# EasyEDA Pro project Smart_System.eprj

# Schematic Schematic1
Create Date: 2024-04-11; Page Name: P1; Project Name: Smart_System; Schematic Name: Schematic1; Update Date: 2024-04-11; Company: 嘉立创EDA; Page Size: A4; Version: V1.0
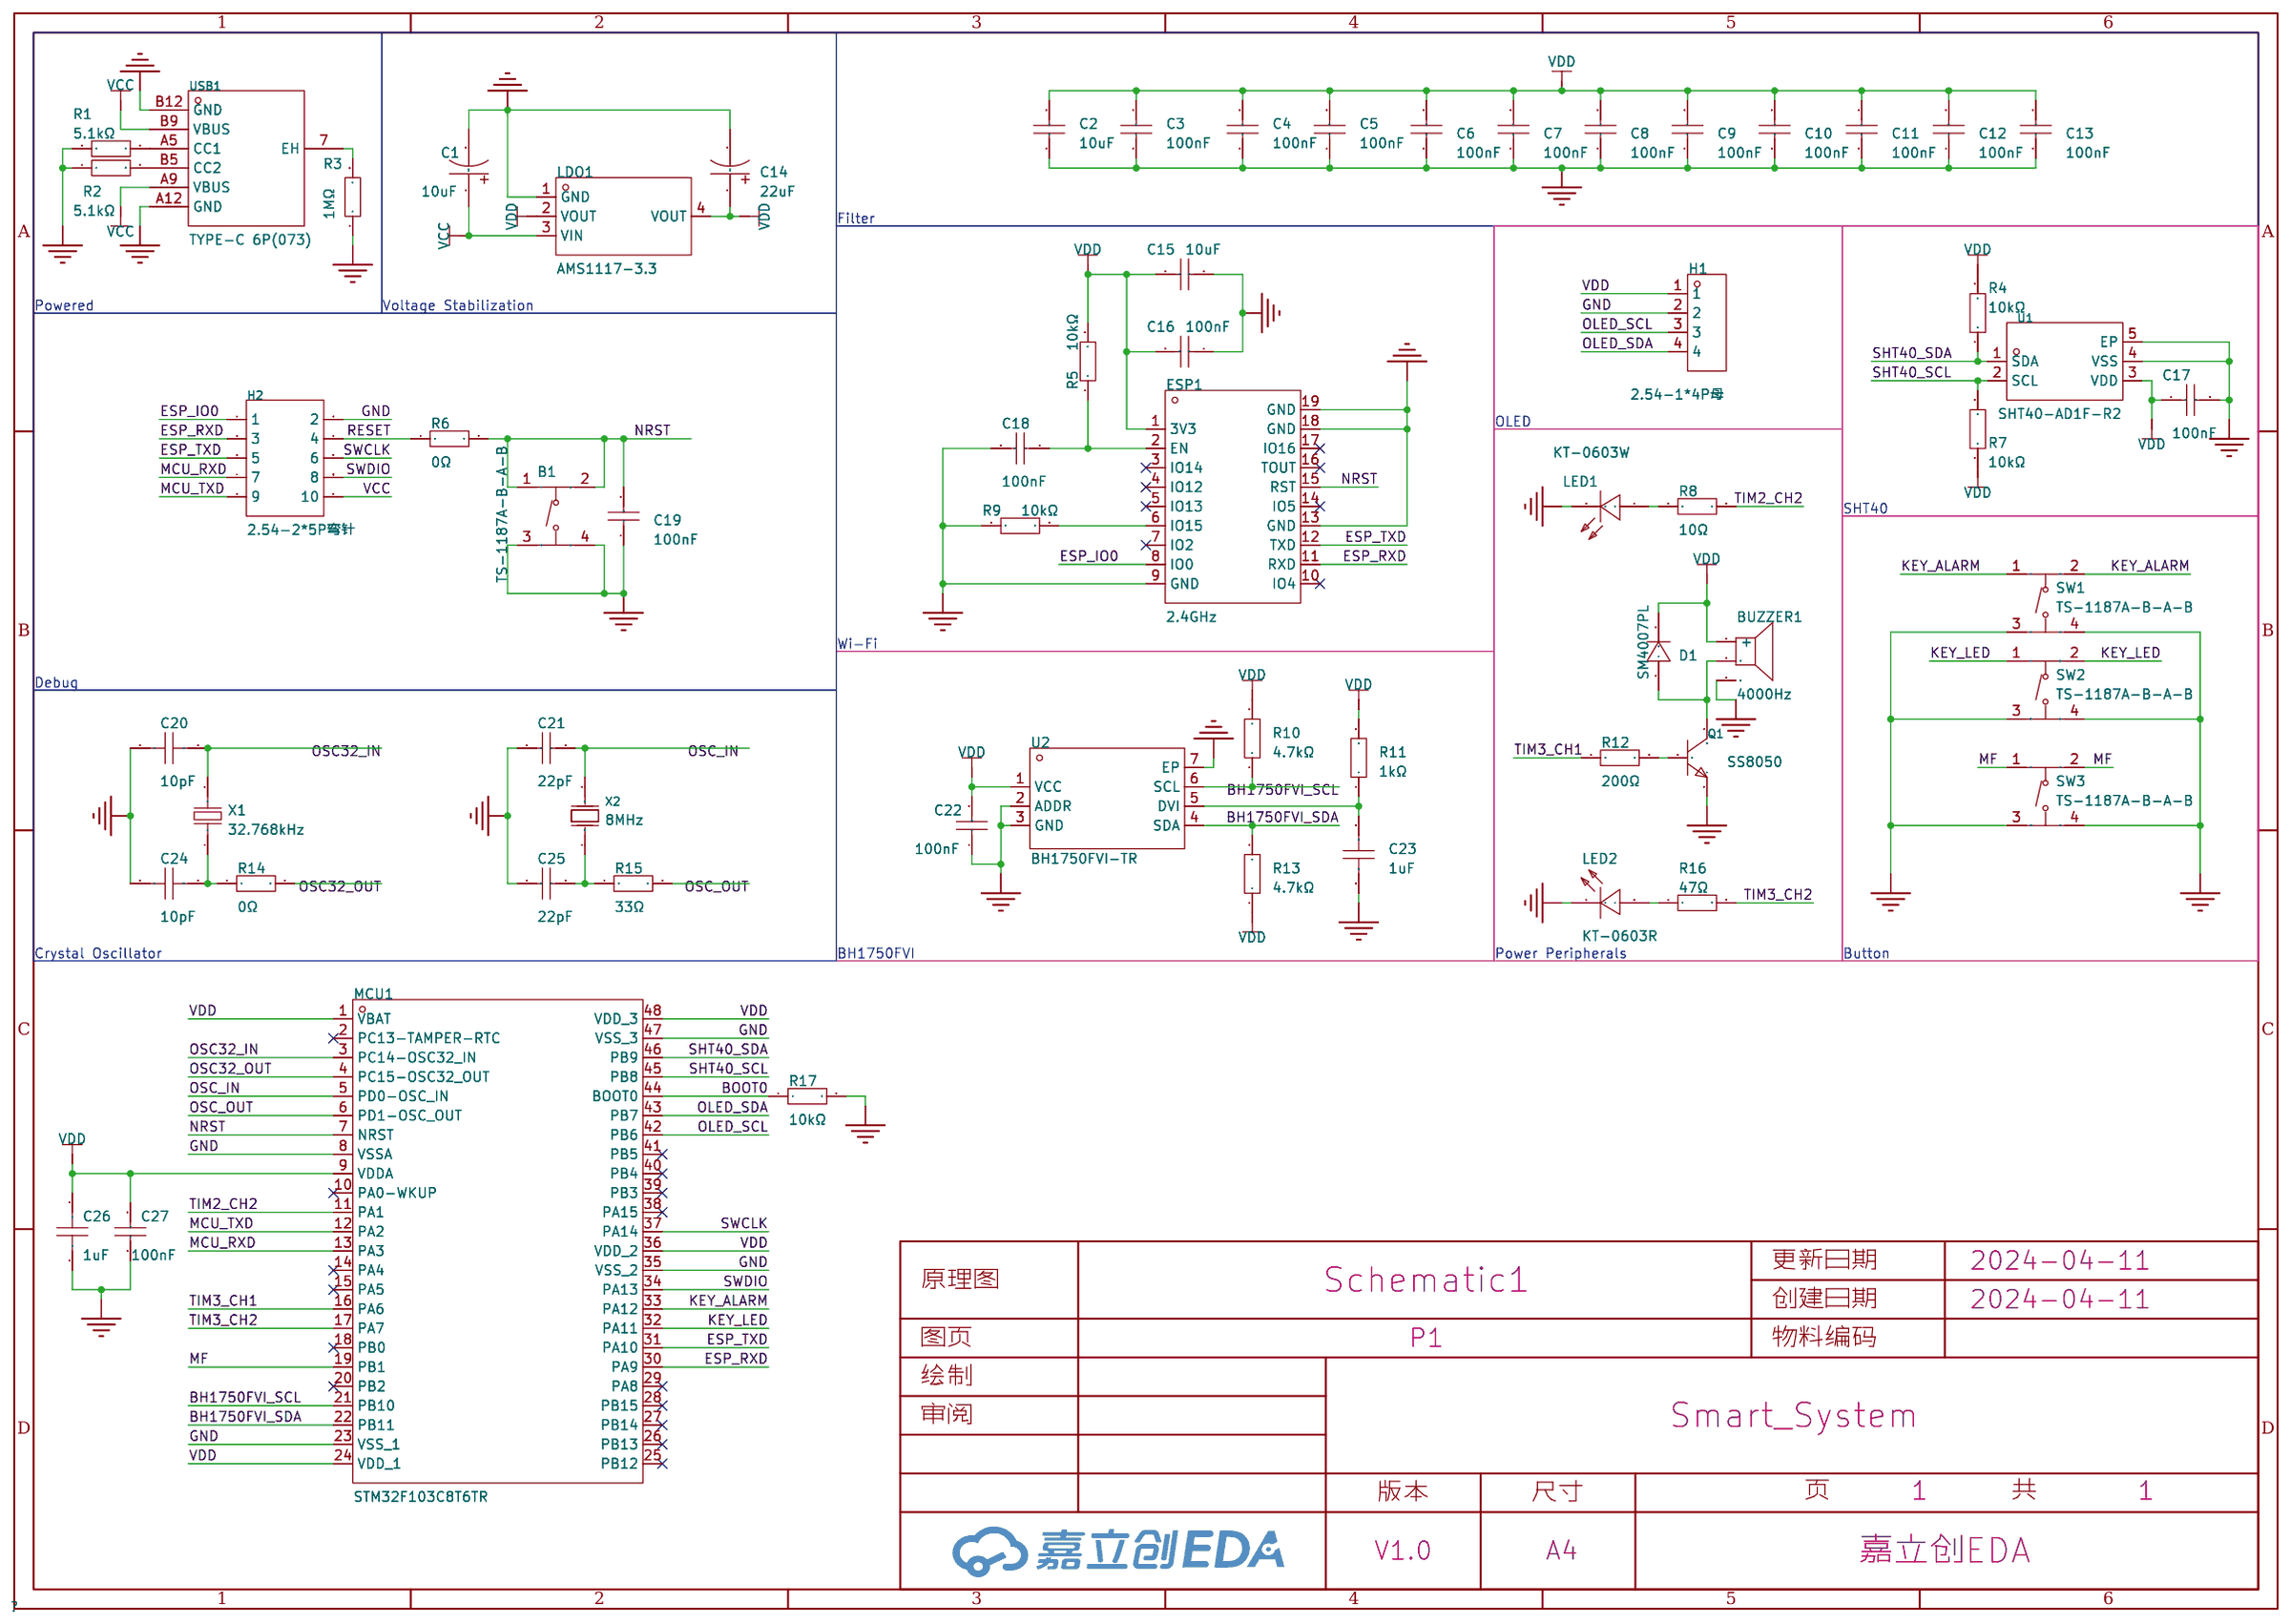
[diagram p0: schematic sheet]

## Parts
B1  TS-1187A-B-A-B  [SW-SMD_4P-L5.1-W5.1-P3.70-LS6.5-TL-2]
BUZZER1  4000Hz  [BUZ-SMD_FST-5018]
C1  10uF  [CAP-SMD_BD3.0-L3.3-W3.3-FD]
C2  10uF  [C0402]
C3  100nF  [C0402]
C4  100nF  [C0402]
C5  100nF  [C0402]
C6  100nF  [C0402]
C7  100nF  [C0402]
C8  100nF  [C0402]
C9  100nF  [C0402]
C10  100nF  [C0402]
C11  100nF  [C0402]
C12  100nF  [C0402]
C13  100nF  [C0402]
C14  22uF  [CAP-SMD_BD3.0-L3.3-W3.3-FD]
C15  10uF  [C0402]
C16  100nF  [C0402]
C17  100nF  [C0402]
C18  100nF  [C0402]
C19  100nF  [C0402]
C20  10pF  [C0402]
C21  22pF  [C0402]
C22  100nF  [C0402]
C23  1uF  [C0402]
C24  10pF  [C0402]
C25  22pF  [C0402]
C26  1uF  [C0402]
C27  100nF  [C0402]
D1  SM4007PL  [SOD-123F_L2.8-W1.8-LS3.7-RD]
ESP1  2.4GHz  [WIFIM-SMD_18P-L18.0-W20.0-P1.50]
H1  2.54-1*4P母  [HDR-TH_4P-P2.54-V-F]
H2  2.54-2*5P弯针  [HDR-TH_10P-P2.54-H-M-R2-C5-S2.54-W12.9]
LDO1  AMS1117-3.3  [SOT-223-3_L6.5-W3.4-P2.30-LS7.0-BR]
LED1  KT-0603W  [LED0603-R-RD_WHITE]
LED2  KT-0603R  [LED0603-RD]
MCU1  STM32F103C8T6TR  [LQFP-48_L7.0-W7.0-P0.50-LS9.0-BL]
Q1  SS8050  [SOT-23-3_L2.9-W1.3-P1.90-LS2.4-BR]
R1  5.1kΩ  [R0603]
R2  5.1kΩ  [R0603]
R3  1MΩ  [R0603]
R4  10kΩ  [R0402]
R5  10kΩ  [R0402]
R6  0Ω  [R0402]
R7  10kΩ  [R0402]
R8  10Ω  [R0402]
R9  10kΩ  [R0402]
R10  4.7kΩ  [R0402]
R11  1kΩ  [R0402]
R12  200Ω  [R0402]
R13  4.7kΩ  [R0402]
R14  0Ω  [R0402]
R15  33Ω  [R0402]
R16  47Ω  [R0603]
R17  10kΩ  [R0402]
SW1  TS-1187A-B-A-B  [SW-SMD_4P-L5.1-W5.1-P3.70-LS6.5-TL-2]
SW2  TS-1187A-B-A-B  [SW-SMD_4P-L5.1-W5.1-P3.70-LS6.5-TL-2]
SW3  TS-1187A-B-A-B  [SW-SMD_4P-L5.1-W5.1-P3.70-LS6.5-TL-2]
U1  SHT40-AD1F-R2  [DFN-4_L1.5-W1.5-P0.80-TL-EP]
U2  BH1750FVI-TR  [WSOF-6_L2.6-W1.6-P0.50-TL-EP]
USB1  TYPE-C 6P(073)  [TYPE-C-SMD_TYPE-C-6P]
X1  32.768kHz  [FC-135R_L3.2-W1.5]
X2  8MHz  [CRYSTAL-SMD_L5.0-W3.2]

## Library data of the parts
B1 SW1-SW3 = TS-1187A-B-A-B: 触点电流:50mA;额定电压(DC):12V;绝缘电阻:-;电路结构:单刀单掷;安装方式:立贴;带灯:无;作用力:160gf;机械寿命:10万次;带支架:否;; LCSC Part Name: 5.1*5.1*1.5mm 立贴 轻触开关 防水金属头; Supplier Part: C318884; Manufacturer: XKB Connectivity(中国星坤); Supplier Footprint: SMD; JLCPCB Part Class: 基础库; Datasheet: https://atta.szlcsc.com/upload/public/pdf/source/20200227/C318884_1F20165719E1C4CAA3E10C4C359C6E26.pdf; Supplier: LCSC; Contact Current: 50mA; Voltage Rating (DC): 12V; Circuit: 单刀单掷; Mounting Style: 立贴; Actuator Style: 圆形按钮; Actuator/Cap Color: 金色; With Lamp: 无; Operating Force: 160gf; Mechanical Life: 10万次; Operating Temperature: -30℃~+85℃; Switch Length: 5.1mm; Switch Width: 5.1mm; Switch Height: 1.5mm; Strike Gundam: 否
BUZZER1 = FUET-5018: 驱动方式:无源(外部驱动);构造类型:电磁式;额定电压:3V;工作电压:2V~5V;频率:4000Hz;声压(SPL):75dB@3V,10cm;长度:5.4mm;宽度:5.2mm;高度:2.1mm;; LCSC Part Name: 电压 3V 频率 4KHZ; Supplier Part: C391028; Manufacturer: FUET(福声科技); Supplier Footprint: SMD,5.2x5.4mm; JLCPCB Part Class: 扩展库; Datasheet: https://atta.szlcsc.com/upload/public/pdf/source/20191031/C391028_6BCD6F9247698B2FA578EDE11021CCC5.pdf; Supplier: LCSC; Oscillator Circuit: 无源(外部驱动); Technology Type: 电磁式; Rated Voltage: 3V; Operating Voltage: 2V~5V; Sound Pressure Level (SPL): 75dB@3V,10cm; Length: 5.4mm; Width: 5.2mm; Height: 2.1mm
C1 = VE-100M1CTR-0305: 容值:10uF;精度:±20%;额定电压:16V;纹波电流:-;等效串联电阻:-;; LCSC Part Name: 10uF ±20% 16V; Supplier Part: C249450; Manufacturer: lelon(立隆); Supplier Footprint: SMD,D3xL5.3mm; JLCPCB Part Class: Extended Part; Datasheet: https://atta.szlcsc.com/upload/public/pdf/source/20181115/C249450_E40C6B129E7EA1FA8176B540A70EDECB.pdf; Supplier: LCSC; Tolerance: ±20%; Rated Voltage: 16V; φD: 3mm; L: 5.3mm; Lifetime @ Temp: 2000hrs@85℃; Operating Temperature: -40℃~+85℃
C2 C15 = CL05A106MQ5NUNC: 容值:10uF;精度:±20%;额定电压:6.3V;材质(温度系数):X5R;; LCSC Part Name: 10uF ±20% 6.3V; Supplier Part: C15525; Manufacturer: SAMSUNG(三星); Supplier Footprint: 0402; JLCPCB Part Class: Basic Part; Datasheet: https://atta.szlcsc.com/upload/public/pdf/source/20220823/2B02EE04F8F211D38A52DCB16EB6BEBA.pdf; Supplier: LCSC; Tolerance: ±20%; Voltage Rated: 6.3V; Temperature Coefficient: X5R
C3-C13 C16 C18 C19 C27 = CL05B104KO5NNNC: 容值:100nF;精度:±10%;额定电压:16V;材质(温度系数):X7R;; LCSC Part Name: 100nF ±10% 16V; Supplier Part: C1525; Manufacturer: SAMSUNG(三星); Supplier Footprint: 0402; JLCPCB Part Class: Basic Part; Datasheet: https://atta.szlcsc.com/upload/public/pdf/source/20160218/1457707763339.pdf; Supplier: LCSC; Tolerance: ±10%; Voltage Rated: 16V; Temperature Coefficient: X7R
C14 = VE-220M1ATR-0305: 容值:22uF;精度:±20%;额定电压:10V;纹波电流:-;等效串联电阻:-;; LCSC Part Name: 22uF ±20% 10V; Supplier Part: C249481; Manufacturer: lelon(立隆); Supplier Footprint: SMD,D3xL5.3mm; JLCPCB Part Class: Extended Part; Datasheet: https://atta.szlcsc.com/upload/public/pdf/source/20181106/C249481_539A61700A3BC1DD3A45A0C2AB5D35A6.pdf; Supplier: LCSC; Tolerance: ±20%; Rated Voltage: 10V; φD: 3mm; L: 5.3mm; Lifetime @ Temp: 2000hrs@85℃; Operating Temperature: -40℃~+85℃
C17 C22 = CL05B104KO5NNNC: 容值:100nF;精度:±10%;额定电压:16V;材质(温度系数):X7R;; LCSC Part Name: 100nF ±10% 16V; Supplier Part: C1525; Manufacturer: SAMSUNG(三星); Supplier Footprint: 0402; JLCPCB Part Class: 基础库; Datasheet: https://atta.szlcsc.com/upload/public/pdf/source/20160218/1457707763339.pdf; Supplier: LCSC; Tolerance: ±10%; Voltage Rated: 16V; Temperature Coefficient: X7R
C20 C24 = CL05C100JB5NNNC: 容值:10pF;精度:±5%;额定电压:50V;材质(温度系数):C0G;; LCSC Part Name: 10pF ±5% 50V; Supplier Part: C32949; Manufacturer: SAMSUNG(三星); Supplier Footprint: 0402; JLCPCB Part Class: Basic Part; Datasheet: https://atta.szlcsc.com/upload/public/pdf/source/20160103/1457707722238.pdf; Supplier: LCSC; Tolerance: ±5%; Voltage Rated: 50V; Temperature Coefficient: C0G
C21 C25 = 0402CG220J500NT: 容值:22pF;精度:±5%;额定电压:50V;材质(温度系数):C0G;; LCSC Part Name: 22pF ±5% 50V; Supplier Part: C1555; Manufacturer: FH(风华); Supplier Footprint: 0402; JLCPCB Part Class: Basic Part; Datasheet: https://atta.szlcsc.com/upload/public/pdf/source/20200305/C486355_26A10D38EF8C2A5C37091D0039909270.pdf; Supplier: LCSC; Tolerance: ±5%; Voltage Rated: 50V; Temperature Coefficient: C0G
C23 C26 = CL05A105KA5NQNC: 容值:1uF;精度:±10%;额定电压:25V;材质(温度系数):X5R;; LCSC Part Name: 1uF ±10% 25V; Supplier Part: C52923; Manufacturer: SAMSUNG(三星); Supplier Footprint: 0402; JLCPCB Part Class: Basic Part; Datasheet: https://atta.szlcsc.com/upload/public/pdf/source/20160103/1457707735223.pdf; Supplier: LCSC; Tolerance: ±10%; Voltage Rated: 25V; Temperature Coefficient: X5R
D1 = SM4007PL_C64898: 二极管配置:-;正向压降(Vf):1.1V@1A;直流反向耐压(Vr):1kV;平均整流电流(Io):1A;; LCSC Part Name: 电压:1kV 电流:1A; Supplier Part: C64898; Manufacturer: MDD; Supplier Footprint: SOD-123FL; JLCPCB Part Class: Basic Part; Datasheet: https://atta.szlcsc.com/upload/public/pdf/source/20230823/16A8FDE162764C9B685A3717F2DA3690.pdf; Supplier: LCSC; Forward Voltage (Vf@If): 1.1V@1A; Reverse Voltage (Vr): 1kV; Average Rectified Current (Io): 1A; Reverse Leakage Current: 10uA@1kV
ESP1 = ESP-WROOM-02-N4_C529583: 频率:2.4GHz;发射功率:20.5dBm;核心处理器:ESP8266EX;; LCSC Part Name: ESP-WROOM-02-N4; Supplier Part: C529583; Manufacturer: ESPRESSIF(乐鑫); Manufacturer Part: ESP-WROOM-02-N4; Supplier Footprint: SMD-18P; JLCPCB Part Class: 扩展库; Datasheet: https://atta.szlcsc.com/upload/public/pdf/source/20200521/C529583_8D53E26E82F3F756972E34D813E274D9.pdf; Supplier: LCSC; Output Power: 20.5dBm; Core Processor: ESP8266EX; Support Interface: I2C；GPIO；PWM；UART；I2S
H1 = 2.54-1*4P母: 排数:单排;总孔位数:4P;间距:2.54mm;插孔结构:1x4P;行距:-;安装类型:直插;圆孔/方孔:方孔;额定电流:3A;额定电压:-;插孔方向:顶部;塑高:-;触头材质:青铜;触头镀层:-;工作温度范围:-40℃~+105℃;焊接温度(最大值):-;; LCSC Part Name: 间距:2.54mm 1x4P 直插; Supplier Part: C2718488; Manufacturer: BOOMELE(博穆精密); Supplier Footprint: 插件,P=2.54mm; JLCPCB Part Class: 扩展库; Datasheet: https://atta.szlcsc.com/upload/public/pdf/source/20210301/C2718488_F4427B881E42CAA8DDB0B1C12B3A522C.pdf; Supplier: LCSC; Number of Rows: 单排; Number of Holes: 4P; Pitch: 2.54mm; Holes Structure: 1x4P; Mounting Type: 直插; Circular Hole / Square Hole: 方孔; Current Rating (Max): 3A; Holes Direction: 顶部; Contact Material: 青铜; Operating Temperature Range: -40℃~+105℃
H2 = 2.54-2*5P弯针: 间距:2.54mm;总PIN位数:10;排数:2;插针结构:2x5P;行距:2.54mm;安装类型:弯插;圆针/方针:方针;额定电流:3A;额定电压:-;配合针长度:6mm;塑高:2.54mm;触头材质:黄铜;触头镀层:-;工作温度范围:-55℃~+105℃;颜色:黑色;; LCSC Part Name: 2.54mm 2x5P 弯插 方针; Supplier Part: C60563; Manufacturer: BOOMELE(博穆精密); Supplier Footprint: 插件,P=2.54mm; JLCPCB Part Class: 扩展库; Supplier: LCSC; Pitch: 2.54mm; Number of Pins: 10; Number of Rows: 2; Pin Structure: 2x5P; Row Spacing: 2.54mm; Mounting Type: 弯插; Circluar Pins/Square Pins: 方针; Current Rating (Max): 3A; Length of Mating Pin: 6mm; Insulation Height: 2.54mm; Contact Material: 黄铜; Operating Temperature Range: -55℃~+105℃; Color: 黑色
LDO1 = AMS1117-3.3_C6186: 输出类型:固定;输出极性:正;最大输入电压:-;输出电压:3.3V;输出电流:1A;电源纹波抑制比(PSRR):72dB@(120Hz);; LCSC Part Name: 输出3.3V 1A; Supplier Part: C6186; Manufacturer: AMS; Supplier Footprint: SOT-223; JLCPCB Part Class: 基础库; Datasheet: https://atta.szlcsc.com/upload/public/pdf/source/20180727/C6186_7A095716F0823C02F1997A905E26C086.pdf; Supplier: LCSC; Output Type: 固定; Output Polarity: 正; Number of Outputs: 1; Output Voltage: 3.3V; Dropout Voltage: 1.3V@(800mA); Output Current: 1A; Power Supply Rejection Ratio (PSRR): 72dB@(120Hz)
LED1 = KT-0603W: 发光颜色:白色;; LCSC Part Name: 0603 白灯 高亮; Supplier Part: C2290; Manufacturer: KENTO; Supplier Footprint: 0603; JLCPCB Part Class: 基础库; Datasheet: https://atta.szlcsc.com/upload/public/pdf/source/20221101/4C23D5C85BA051E44A00B833D0A41468.pdf; Supplier: LCSC; Emitted Color: 白色
LED2 = KT-0603R: 发光颜色:红灯;二极管配置:-;透镜颜色:-;主波长:-;色温:-;功率:-;发光角度:-;安装方式:-;工作温度:-40℃~+85℃;; LCSC Part Name: 0603 红灯 高亮; Supplier Part: C2286; Manufacturer: KENTO; Supplier Footprint: 0603; JLCPCB Part Class: 基础库; Datasheet: https://atta.szlcsc.com/upload/public/pdf/source/20160616/1466072038404.pdf; Supplier: LCSC; Emitted Color: 红灯; Operating Temperature: -40℃~+85℃
MCU1 = STM32F103C8T6TR: Supplier Part: C2969777; Manufacturer: ST(意法半导体); Supplier Footprint: LQFP-48; JLCPCB Part Class: 扩展库; Datasheet: https://atta.szlcsc.com/upload/public/pdf/source/20220628/95EE8CB51361BFD20205E6D0986143A8.pdf; Supplier: LCSC
Q1 = SS8050_C2150: 晶体管类型:NPN;集射极击穿电压(Vceo):25V;集电极电流(Ic):1.5A;功率(Pd):300mW;直流电流增益(hFE@Ic,Vce):200@100mA,1V;; LCSC Part Name: NPN 耐压:25V 电流:1.5A Y1 200-350; Supplier Part: C2150; Manufacturer: CJ(江苏长电/长晶); Supplier Footprint: SOT-23; JLCPCB Part Class: Basic Part; Datasheet: https://atta.szlcsc.com/upload/public/pdf/source/20230322/AEE86F4B043774EFF80CAEA14A37D9E9.pdf; Supplier: LCSC; Transistor Type: NPN; Collector-Emitter Breakdown Voltage (Vceo): 25V; Collector Current (Ic): 1.5A; Power Dissipation (Pd): 300mW; Collector Cut-Off Current (Icbo): 100nA; Collector-Emitter Saturation Voltage (VCE(sat)@Ic,Ib): 500mV@800mA,80mA; DC Current Gain (hFE@Ic,Vce): 200@100mA,1V; Transition Frequency (fT): 100MHz; Operating Temperature: +150℃@(Tj)
R1 R2 = 0603WAF5101T5E: 阻值:5.1kΩ;精度:±1%;功率:100mW;温度系数:±100ppm/℃;电阻类型:厚膜电阻;; LCSC Part Name: 5.1kΩ ±1% 100mW 厚膜电阻; Supplier Part: C23186; Manufacturer: UNI-ROYAL(厚声); Supplier Footprint: 0603; JLCPCB Part Class: Basic Part; Datasheet: https://atta.szlcsc.com/upload/public/pdf/source/20200306/C422600_1E6D84923E4A46A82E41ADD87F860B5C.pdf; Supplier: LCSC; Type: 厚膜电阻; Tolerance: ±1%; Power(Watts): 100mW; Temperature Coefficient: ±100ppm/℃; Overload Voltage (Max): 75V; Operating Temperature Range: -55℃~+155℃
R3 = 0603WAF1004T5E: 阻值:1MΩ;精度:±1%;功率:100mW;温度系数:±100ppm/℃;电阻类型:厚膜电阻;; LCSC Part Name: 1MΩ ±1% 100mW 厚膜电阻; Supplier Part: C22935; Manufacturer: UNI-ROYAL(厚声); Supplier Footprint: 0603; JLCPCB Part Class: Basic Part; Datasheet: https://atta.szlcsc.com/upload/public/pdf/source/20200306/C422600_1E6D84923E4A46A82E41ADD87F860B5C.pdf; Supplier: LCSC; Type: 厚膜电阻; Tolerance: ±1%; Power(Watts): 100mW; Temperature Coefficient: ±100ppm/℃; Overload Voltage (Max): 75V; Operating Temperature Range: -55℃~+155℃
R4 R7 = 0402WGF1002TCE: 电阻类型:厚膜电阻;阻值:10kΩ;精度:±1%;功率:62.5mW;温度系数:±100ppm/℃;; LCSC Part Name: 厚膜电阻 10kΩ ±1% 62.5mW; Supplier Part: C25744; Manufacturer: UNI-ROYAL(厚声); Supplier Footprint: 0402; JLCPCB Part Class: 基础库; Datasheet: https://atta.szlcsc.com/upload/public/pdf/source/20200306/C422600_1E6D84923E4A46A82E41ADD87F860B5C.pdf; Supplier: LCSC; Type: 厚膜电阻; Tolerance: ±1%; Power(Watts): 62.5mW; Temperature Coefficient: ±100ppm/℃; Overload Voltage (Max): 50V; Operating Temperature Range: -55℃~+155℃
R5 R9 R17 = 0402WGF1002TCE: 电阻类型:厚膜电阻;阻值:10kΩ;精度:±1%;功率:62.5mW;温度系数:±100ppm/℃;; LCSC Part Name: 厚膜电阻 10kΩ ±1% 62.5mW; Supplier Part: C25744; Manufacturer: UNI-ROYAL(厚声); Supplier Footprint: 0402; JLCPCB Part Class: Basic Part; Datasheet: https://atta.szlcsc.com/upload/public/pdf/source/20200306/C422600_1E6D84923E4A46A82E41ADD87F860B5C.pdf; Supplier: LCSC; Type: 厚膜电阻; Tolerance: ±1%; Power(Watts): 62.5mW; Temperature Coefficient: ±100ppm/℃; Overload Voltage (Max): 50V; Operating Temperature Range: -55℃~+155℃
R6 R14 = 0402WGF0000TCE: 阻值:0Ω;精度:±1%;功率:62.5mW;温度系数:±800ppm/℃;电阻类型:厚膜电阻;; LCSC Part Name: 0Ω ±1% 62.5mW 厚膜电阻; Supplier Part: C17168; Manufacturer: UNI-ROYAL(厚声); Supplier Footprint: 0402; JLCPCB Part Class: Basic Part; Datasheet: https://atta.szlcsc.com/upload/public/pdf/source/20200306/C422600_1E6D84923E4A46A82E41ADD87F860B5C.pdf; Supplier: LCSC; Tolerance: ±1%; Power(Watts): 62.5mW; Overload Voltage (Max): 50V; Temperature Coefficient: ±800ppm/℃; Type: 厚膜电阻; Operating Temperature Range: -55℃~+155℃
R8 = 0402WGF100JTCE: 电阻类型:厚膜电阻;阻值:10Ω;精度:±1%;功率:62.5mW;最大工作电压:50V;温度系数:±200ppm/℃;; LCSC Part Name: 10Ω ±1% 62.5mW 厚膜电阻; Supplier Part: C25077; Manufacturer: UNI-ROYAL(厚声); Supplier Footprint: 0402; JLCPCB Part Class: Basic Part; Datasheet: https://atta.szlcsc.com/upload/public/pdf/source/20200306/C422600_1E6D84923E4A46A82E41ADD87F860B5C.pdf; Supplier: LCSC; Type: 厚膜电阻; Tolerance: ±1%; Power(Watts): 62.5mW; Overload Voltage (Max): 50V; Temperature Coefficient: ±200ppm/℃; Operating Temperature Range: -55℃~+155℃
R10 R13 = 0402WGF4701TCE: 电阻类型:厚膜电阻;阻值:4.7kΩ;精度:±1%;功率:62.5mW;温度系数:±100ppm/℃;; LCSC Part Name: 厚膜电阻 4.7kΩ ±1% 62.5mW; Supplier Part: C25900; Manufacturer: UNI-ROYAL(厚声); Supplier Footprint: 0402; JLCPCB Part Class: 基础库; Datasheet: https://atta.szlcsc.com/upload/public/pdf/source/20200306/C422600_1E6D84923E4A46A82E41ADD87F860B5C.pdf; Supplier: LCSC; Type: 厚膜电阻; Tolerance: ±1%; Power(Watts): 62.5mW; Temperature Coefficient: ±100ppm/℃; Overload Voltage (Max): 50V; Operating Temperature Range: -55℃~+155℃
R11 = 0402WGF1001TCE: 电阻类型:厚膜电阻;阻值:1kΩ;精度:±1%;功率:62.5mW;; LCSC Part Name: 1kΩ ±1% 62.5mW; Supplier Part: C11702; Manufacturer: UNI-ROYAL(厚声); Supplier Footprint: 0402; JLCPCB Part Class: Basic Part; Datasheet: https://atta.szlcsc.com/upload/public/pdf/source/20200306/C422600_1E6D84923E4A46A82E41ADD87F860B5C.pdf; Supplier: LCSC; Type: 厚膜电阻; Tolerance: ±1%; Power(Watts): 62.5mW; Temperature Coefficient: ±100ppm/℃; Overload Voltage (Max): 50V; Operating Temperature Range: -55℃~+155℃
R12 = 0402WGF2000TCE: 阻值:200Ω;精度:±1%;功率:62.5mW;温度系数:±100ppm/℃;电阻类型:厚膜电阻;; LCSC Part Name: 200Ω ±1% 62.5mW 厚膜电阻; Supplier Part: C25087; Manufacturer: UNI-ROYAL(厚声); Supplier Footprint: 0402; JLCPCB Part Class: Basic Part; Datasheet: https://atta.szlcsc.com/upload/public/pdf/source/20200306/C422600_1E6D84923E4A46A82E41ADD87F860B5C.pdf; Supplier: LCSC; Type: 厚膜电阻; Tolerance: ±1%; Power(Watts): 62.5mW; Temperature Coefficient: ±100ppm/℃; Overload Voltage (Max): 50V; Operating Temperature Range: -55℃~+155℃
R15 = 0402WGF330JTCE: 阻值:33Ω;精度:±1%;功率:62.5mW;温度系数:±100ppm/℃;电阻类型:厚膜电阻;; LCSC Part Name: 33Ω ±1% 62.5mW 厚膜电阻; Supplier Part: C25105; Manufacturer: UNI-ROYAL(厚声); Supplier Footprint: 0402; JLCPCB Part Class: Basic Part; Datasheet: https://atta.szlcsc.com/upload/public/pdf/source/20200306/C422600_1E6D84923E4A46A82E41ADD87F860B5C.pdf; Supplier: LCSC; Tolerance: ±1%; Power(Watts): 62.5mW; Overload Voltage (Max): 50V; Temperature Coefficient: ±100ppm/℃; Type: 厚膜电阻; Operating Temperature Range: -55℃~+155℃
R16 = 0603WAF470JT5E: 阻值:47Ω;精度:±1%;功率:100mW;温度系数:±100ppm/℃;电阻类型:厚膜电阻;; LCSC Part Name: 47Ω ±1% 100mW 厚膜电阻; Supplier Part: C23182; Manufacturer: UNI-ROYAL(厚声); Supplier Footprint: 0603; JLCPCB Part Class: Basic Part; Datasheet: https://atta.szlcsc.com/upload/public/pdf/source/20200306/C422600_1E6D84923E4A46A82E41ADD87F860B5C.pdf; Supplier: LCSC; Tolerance: ±1%; Power(Watts): 100mW; Overload Voltage (Max): 75V; Temperature Coefficient: ±100ppm/℃; Type: 厚膜电阻; Operating Temperature Range: -55℃~+155℃
U1 = SHT40-AD1F-R2: LCSC Part Name: 3.000.820; Supplier Part: C7461846; Manufacturer: Sensirion(瑞士盛思锐); Supplier: LCSC
U2 = BH1750FVI-TR: 数字16-bit I2C串行输出，环境光传感器，工作电压：2.4V~3.6V; Supplier Part: C78960; Manufacturer: ROHM(罗姆); Supplier Footprint: WSOF-6; JLCPCB Part Class: 扩展库; Datasheet: https://atta.szlcsc.com/upload/public/pdf/source/20160723/1469258984787.pdf; Supplier: LCSC
USB1 = TYPE-C 6P(073): 连接器类型:Type-C;标准:-;公母:母座;触点数量:6P;端口数量:1;安装方式:卧贴;额定电流 - 电源:5A;工作温度范围:-25℃~+85℃;; LCSC Part Name: Type-C 母座 卧贴; Supplier Part: C668623; Manufacturer: SHOU HAN(首韩); Supplier Footprint: SMD; JLCPCB Part Class: 扩展库; Datasheet: https://atta.szlcsc.com/upload/public/pdf/source/20200618/C668623_A4B260DED7AC1949BAC6AE39E9F4CD80.pdf; Supplier: LCSC; Connector Type: Type-C; Gender: 母座; Number of Contacts: 6P; Number of Ports: 1; Mounting Style: 卧贴; Current Rating - Power (Max): 5A; Operating Temperature Range: -25℃~+85℃
X1 = Q13FC1350000400: 频率:32.768kHz;频率公差:±20ppm;负载电容:12.5pF;; LCSC Part Name: 32.768kHz ±20ppm 12.5pF; Supplier Part: C32346; Manufacturer: EPSON(爱普生); Supplier Footprint: SMD3215-2P; JLCPCB Part Class: Basic Part; Datasheet: https://atta.szlcsc.com/upload/public/pdf/source/20190108/C32346_746D6B07EAF90824457A96480007685F.pdf; Supplier: LCSC; Crystal Type: 贴片无源晶振; Frequency Tolerance: ±20ppm; Load Capacitance: 12.5pF; Equivalent Series Resistance (ESR): 70kΩ; Operating Temperature: -40℃~+85℃
X2 = X50328MSB2GI: 频率:8MHz;负载电容:20pF;频率公差:±10ppm;; LCSC Part Name: 8MHz ±10ppm 20pF YSX530GA YSX530GA; Supplier Part: C115962; Manufacturer: YXC(扬兴晶振); Supplier Footprint: SMD5032-2P; JLCPCB Part Class: Basic Part; Datasheet: https://atta.szlcsc.com/upload/public/pdf/source/20230220/0EBFFB9D6D8CE6A211407822BBB6C516.pdf; Supplier: LCSC; Crystal Type: 贴片无源晶振; Frequency Tolerance: ±10ppm; Frequency Stability: ±50ppm; Load Capacitance: 20pF; Operating Temperature: -40℃~+85℃

## Nets
GND: B1.3(C) B1.4(D) BUZZER1.3 C1.2 C2.1 C3.1 C4.1 C5.1 C6.1 C7.1 C8.1 C9.1 C10.1 C11.1 C12.1 C13.1 C14.2 C15.2 C16.1 C17.2 C18.2 C19.1 C20.1 C21.1 C22.1 C23.1 C24.1 C25.1 C26.1 C27.1 ESP1.9(GND) ESP1.13(GND) ESP1.18(GND) ESP1.19(GND) H1.2 H2.2 LDO1.1(GND) LED1.2(K) LED2.1(K) MCU1.8(VSSA) MCU1.23(VSS_1) MCU1.35(VSS_2) MCU1.47(VSS_3) Q1.2(E) R1.1 R2.1 R3.1 R9.1 R17.2 SW1.3(C) SW1.4(D) SW2.3(C) SW2.4(D) SW3.3(C) SW3.4(D) U1.4(VSS) U1.5(EP) U2.2(ADDR) U2.3(GND) U2.7(EP) USB1.A12(GND) USB1.B12(GND)
VCC: C1.1 H2.10 LDO1.3(VIN) USB1.A9(VBUS) USB1.B9(VBUS)
VDD: BUZZER1.1(+) C2.2 C3.2 C4.2 C5.2 C6.2 C7.2 C8.2 C9.2 C10.2 C11.2 C12.2 C13.2 C14.1 C15.1 C16.2 C17.1 C22.2 C26.2 C27.2 D1.1(C) ESP1.1(3V3) H1.1 LDO1.2(VOUT) LDO1.4(VOUT) MCU1.1(VBAT) MCU1.9(VDDA) MCU1.24(VDD_1) MCU1.36(VDD_2) MCU1.48(VDD_3) R4.2 R5.2 R7.1 R10.2 R11.2 R13.1 U1.3(VDD) U2.1(VCC)
BH1750FVI_SCL: MCU1.21(PB10) R10.1 U2.6(SCL)
BH1750FVI_SDA: MCU1.22(PB11) R13.2 U2.4(SDA)
BOOT0: MCU1.44(BOOT0) R17.1
ESP_IO0: ESP1.8(IO0) H2.1
ESP_RXD: ESP1.11(RXD) H2.3 MCU1.30(PA9)
ESP_TXD: ESP1.12(TXD) H2.5 MCU1.31(PA10)
KEY_ALARM: MCU1.33(PA12) SW1.1(A) SW1.2(B)
KEY_LED: MCU1.32(PA11) SW2.1(A) SW2.2(B)
MCU_RXD: H2.7 MCU1.13(PA3)
MCU_TXD: H2.9 MCU1.12(PA2)
MF: MCU1.19(PB1) SW3.1(A) SW3.2(B)
NRST: B1.1(A) B1.2(B) C19.2 ESP1.15(RST) MCU1.7(NRST) R6.2
OLED_SCL: H1.3 MCU1.42(PB6)
OLED_SDA: H1.4 MCU1.43(PB7)
OSC32_IN: C20.2 MCU1.3(PC14-OSC32_IN) X1.2
OSC32_OUT: MCU1.4(PC15-OSC32_OUT) R14.2
OSC_IN: C21.2 MCU1.5(PD0-OSC_IN) X2.2(OSC2)
OSC_OUT: MCU1.6(PD1-OSC_OUT) R15.2
RESET: H2.4 R6.1
SHT40_SCL: MCU1.45(PB8) R7.2 U1.2(SCL)
SHT40_SDA: MCU1.46(PB9) R4.1 U1.1(SDA)
SWCLK: H2.6 MCU1.37(PA14)
SWDIO: H2.8 MCU1.34(PA13)
TIM2_CH2: MCU1.11(PA1) R8.1
TIM3_CH1: MCU1.16(PA6) R12.1
TIM3_CH2: MCU1.17(PA7) R16.2
Net-(BUZZER1-2): BUZZER1.2 D1.2(A) Q1.3(C)
Net-(C18-1): C18.1 ESP1.2(EN) R5.1
Net-(C23-2): C23.2 R11.1 U2.5(DVI)
Net-(C24-2): C24.2 R14.1 X1.1
Net-(C25-2): C25.2 R15.1 X2.1(OSC1)
Net-(ESP1-6): ESP1.6(IO15) R9.2
Net-(LED1-1): LED1.1(A) R8.2
Net-(LED2-2): LED2.2(A) R16.1
Net-(Q1-1): Q1.1(B) R12.2
Net-(R1-2): R1.2 USB1.A5(CC1)
Net-(R2-2): R2.2 USB1.B5(CC2)
Net-(R3-2): R3.2 USB1.7(EH)

Not connected (* = marked no-connect by the designer): ESP1 3(IO14)* 4(IO12)* 5(IO13)* 7(IO2)* 10(IO4)* 14(IO5)* 16(TOUT)* 17(IO16)*; MCU1 2(PC13-TAMPER-RTC)* 10(PA0-WKUP)* 14(PA4)* 15(PA5)* 18(PB0)* 20(PB2)* 25(PB12)* 26(PB13)* 27(PB14)* 28(PB15)* 29(PA8)* 38(PA15)* 39(PB3)* 40(PB4)* 41(PB5)*

## Notes on the sheet
- Filter
- Powered
- Voltage Stabilization
- OLED
- SHT40
- Wi-Fi
- Debug
- Crystal Oscillator
- BH1750FVI
- Power Peripherals
- Button
